# EAGLE design PCB (EAGLE 9.5.1)
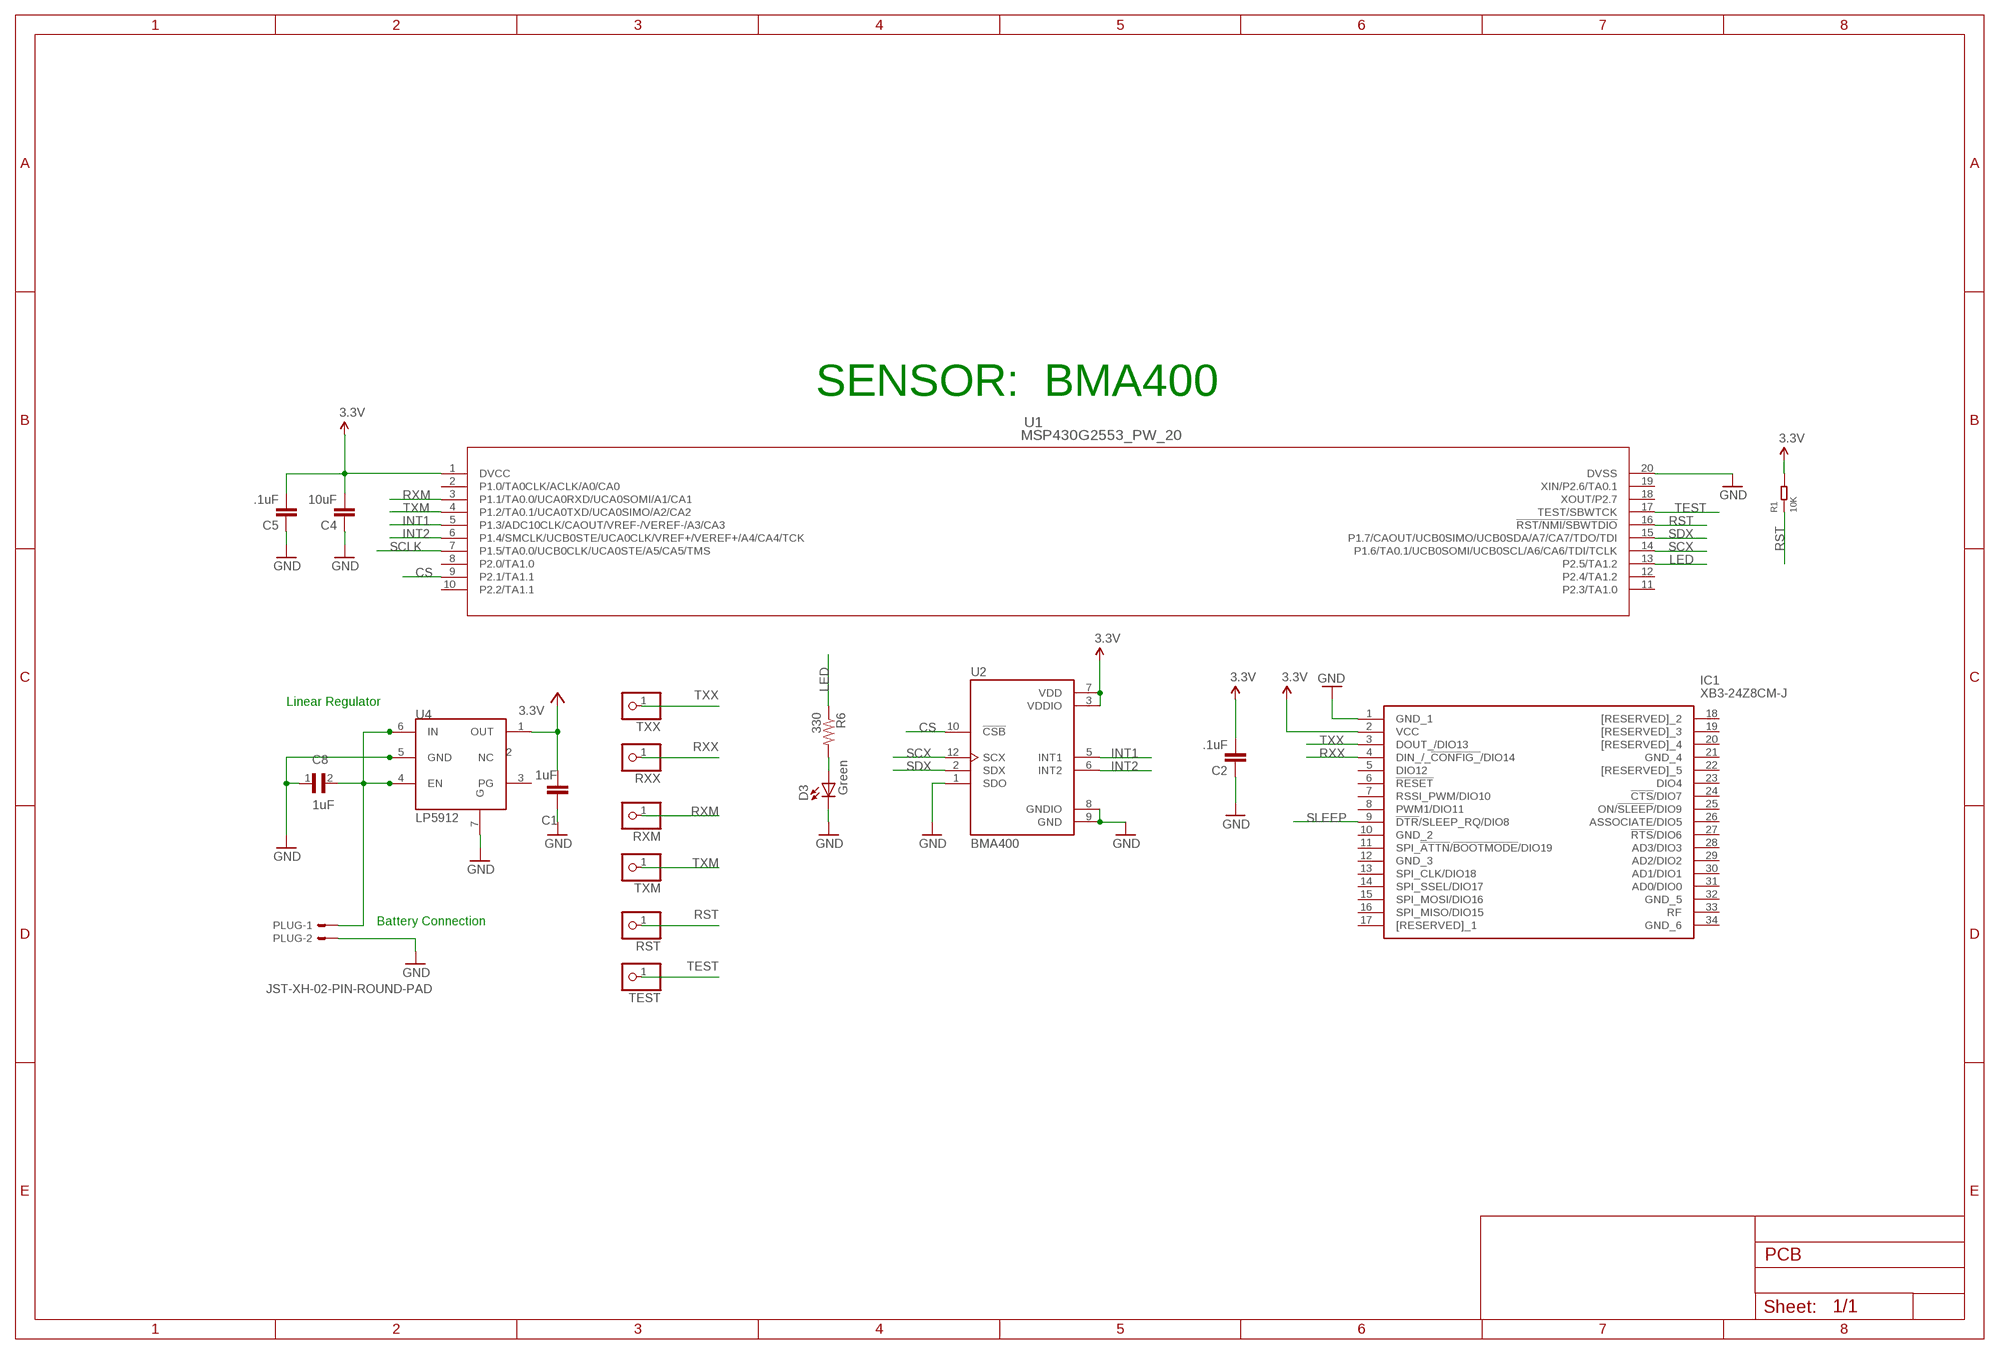
[diagram p0: schematic, sheet 1]

## Parts
C1  1uF  C-EUC0603  [C0603]
C2  .1uF  0.1UF-25V(+80/-20%)(0603)  [0603-CAP]
C4  10uF  0.1UF-25V(+80/-20%)(0603)  [0603-CAP]
C5  .1uF  0.1UF-25V(+80/-20%)(0603)  [0603-CAP]
C8  1uF  0402YD105MAT2A  [CAPC1005X71N]
D3  Green  LED  [0603-LED-ALT1]
IC1  XB3-24Z8CM-J  [XB324Z8CMJ]
PLUG  JST-XH-02-PIN-ROUND-PAD  [JST-XH-02-PACKAGE-ROUND-PAD]
R1  10K  SMD-RES-4.7K-5%-1/16W(0402)  [R0402]
R6  330  RESISTOR0603-RES  [0603-RES]
RST  PINHD-1X1  [1X01]
RXM  PINHD-1X1  [1X01]
RXX  PINHD-1X1  [1X01]
TEST  PINHD-1X1  [1X01]
TXM  PINHD-1X1  [1X01]
TXX  PINHD-1X1  [1X01]
U1  MSP430G2553_PW_20  [PW20]
U2  BMA400  [XDCR_BMA400]
U4  LP5912  [LP5912]

## Nets
3.3V: C2.2 C4.2 C5.2 IC1.2(VCC) R1.2 U1.1(DVCC) U2.3(VDDIO) U2.7(VDD)
BATTERY: C8.2 PLUG.1 U4.4(EN) U4.6(IN)
CS: U1.9(P2.1/TA1.1) U2.10(!CSB)
GND [vcc]: C1.1 C2.1 C4.1 C5.1 C8.1 D3.C IC1.1(GND_1) PLUG.2 U1.20(DVSS) U2.1(SDO) U2.8(GNDIO) U2.9(GND) U4.5(GND) U4.7(G)
INT1: U1.5(P1.3/ADC10CLK/CAOUT/VREF-/VEREF-/A3/CA3) U2.5(INT1)
INT2: U1.6(P1.4/SMCLK/UCB0STE/UCA0CLK/VREF+/VEREF+/A4/CA4/TCK) U2.6(INT2)
LED: R6.1 U1.13(P2.5/TA1.2)
N$7: D3.A R6.2
RST: R1.1 RST.1 U1.16(!RST/NMI/SBWTDIO)
RXM: RXM.1 U1.3(P1.1/TA0.0/UCA0RXD/UCA0SOMI/A1/CA1)
RXX: IC1.4(DIN_/_!CONFIG_!/DIO14) RXX.1
SCLK: U1.7(P1.5/TA0.0/UCB0CLK/UCA0STE/A5/CA5/TMS)
SCX: U1.14(P1.6/TA0.1/UCB0SOMI/UCB0SCL/A6/CA6/TDI/TCLK) U2.12(SCX)
SDX: U1.15(P1.7/CAOUT/UCB0SIMO/UCB0SDA/A7/CA7/TDO/TDI) U2.2(SDX)
SLEEP: IC1.9(!DTR!/SLEEP_RQ/DIO8)
TEST: TEST.1 U1.17(TEST/SBWTCK)
TXM: TXM.1 U1.4(P1.2/TA0.1/UCA0TXD/UCA0SIMO/A2/CA2)
TXX: IC1.3(DOUT_/DIO13) TXX.1
VCC: C1.2 U4.1(OUT) ; supply symbol labelled 3.3V
Unconnected: IC1.5(DIO12) IC1.6(!RESET) IC1.7(RSSI_PWM/DIO10) IC1.8(PWM1/DIO11) IC1.10(GND_2) IC1.11(SPI_!ATTN!/!BOOTMODE!/DIO19) IC1.12(GND_3) IC1.13(SPI_CLK/DIO18) IC1.14(SPI_SSEL/DIO17) IC1.15(SPI_MOSI/DIO16) IC1.16(SPI_MISO/DIO15) IC1.17([RESERVED]_1) IC1.18([RESERVED]_2) IC1.19([RESERVED]_3) IC1.20([RESERVED]_4) IC1.21(GND_4) IC1.22([RESERVED]_5) IC1.23(DIO4) IC1.24(!CTS!/DIO7) IC1.25(ON/!SLEEP!/DIO9) IC1.26(ASSOCIATE/DIO5) IC1.27(!RTS!/DIO6) IC1.28(AD3/DIO3) IC1.29(AD2/DIO2) IC1.30(AD1/DIO1) IC1.31(AD0/DIO0) IC1.32(GND_5) IC1.33(RF) IC1.34(GND_6) U1.2(P1.0/TA0CLK/ACLK/A0/CA0) U1.8(P2.0/TA1.0) U1.10(P2.2/TA1.1) U1.11(P2.3/TA1.0) U1.12(P2.4/TA1.2) U1.18(XOUT/P2.7) U1.19(XIN/P2.6/TA0.1) U4.2(NC) U4.3(PG)

## Notes on the sheet
- SENSOR:  BMA400
- Linear Regulator
- Battery Connection

## Library data of the parts
C1 = rcl:C-EU: CAPACITOR, European symbol; SPICEPREFIX: C
C2 C4 C5 = SparkFun-Capacitors:0.1UF-25V(+80/-20%)(0603): CAP-00810 Ceramic Standard decoupling cap; PROD_ID: CAP-00810; VALUE: 0.1uF
C8 = Capacitor1uF:0402YD105MAT2A: CAP 1UF 16VDC X5R 20% SMD 0402; AVAILABILITY: Unavailable; DESCRIPTION: Cap 1uf 16vdc X5r 20% Smd 0402; MF: AVX; MP: 0402YD105MAT2A; PACKAGE: 1005 AVX; PRICE: None
D3 = Testing:LED: LEDs Standard schematic elements and footprints for 5mm, 3mm, 1206, and 0603 sized LEDs. 5mm - Spark Fun Electronics SKU : COM-00529 (and others)
IC1 = XB3-24Z8CM-J:XB3-24Z8CM-J: Zigbee Modules (802.15.4) XBee3 ,2.4 Ghz ZB 3.0, Chip Ant, MMT Source: Datasheet <https://www.digi.com/resources/documentation/digidocs/pdfs/90001543.pdf>; DESCRIPTION: Zigbee Modules (802.15.4) XBee3 ,2.4 Ghz ZB 3.0, Chip Ant, MMT; HEIGHT: 4mm; MANUFACTURER_NAME: Digi International; MANUFACTURER_PART_NUMBER: XB3-24Z8CM-J; MOUSER_PART_NUMBER: 888-XB3-24Z8CM-J; MOUSER_PRICE-STOCK: https://www.mouser.com/Search/Refine.aspx?Keyword=888-XB3-24Z8CM-J
PLUG = Rembrandt Electronics - JST XH Connectors v1-0:JST-XH-02-PIN: JST XH Connector 2 Pin Wire to board connector. Pitch: 2,54 mm, (0.100") Number of pins: 2 Created by Rembrandt Electronics www.rembrandtelectronics.com
R1 = RES-4.7K-SMD-5_-1_16W_0402_:SMD-RES-4.7K-5%-1/16W(0402): 301010010; AVAILABILITY: Unavailable; DESCRIPTION: Res Thick Film 0402 4.7K Ohm 5% 0.063W_1/16W_ ?100ppm/C Molded SMD Paper T/R; MF: Yageo; MP: RC0402JR074K7L; PACKAGE: 0402 Yageo; PRICE: None
R6 = SparkFun:RESISTOR: Resistor Basic schematic elements and footprints for 0603, 1206, and PTH resistors.
RST RXM RXX TEST TXM TXX = pinhead:PINHD-1X1: PIN HEADER
U1 = MSP430G2553_PW_20:MSP430G2553_PW_20; BUILT_BY: EMA_UL_Team; MANUFACTURER: Texas Instruments; MANUFACTURER_PART_NUMBER: MSP430G2553_PW_20; VENDOR: Texas Instruments
U2 = BMA400:BMA400: Ultra low power, 12-bit digital triaxial accelerometer; AVAILABILITY: Unavailable; DESCRIPTION: Accelerometer X, Y, Z Axis ±2g, 4g, 8g, 16g 12-LGA _2x2_; MF: Bosch Sensortec; MP: BMA400; PACKAGE: LGA-12 Bosch Tools; PRICE: None
U4 = electronic-labs:LP5912

## Net classes
0 default: width 0.203 mm
1 vcc: width 0.254 mm

## Board
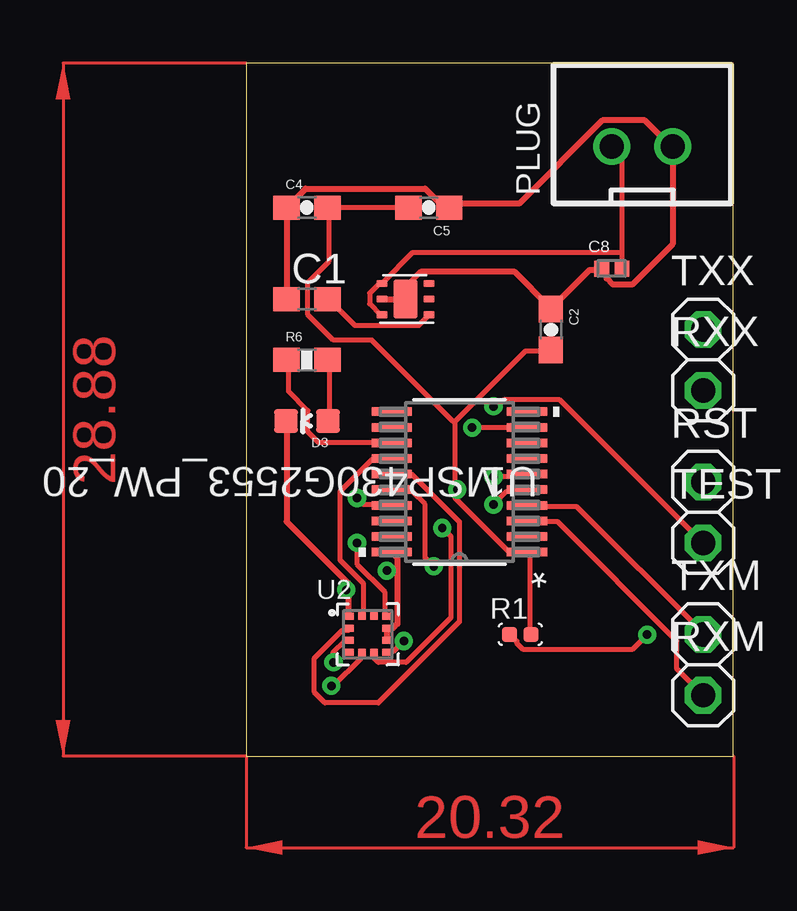
[diagram p1: board, top side]
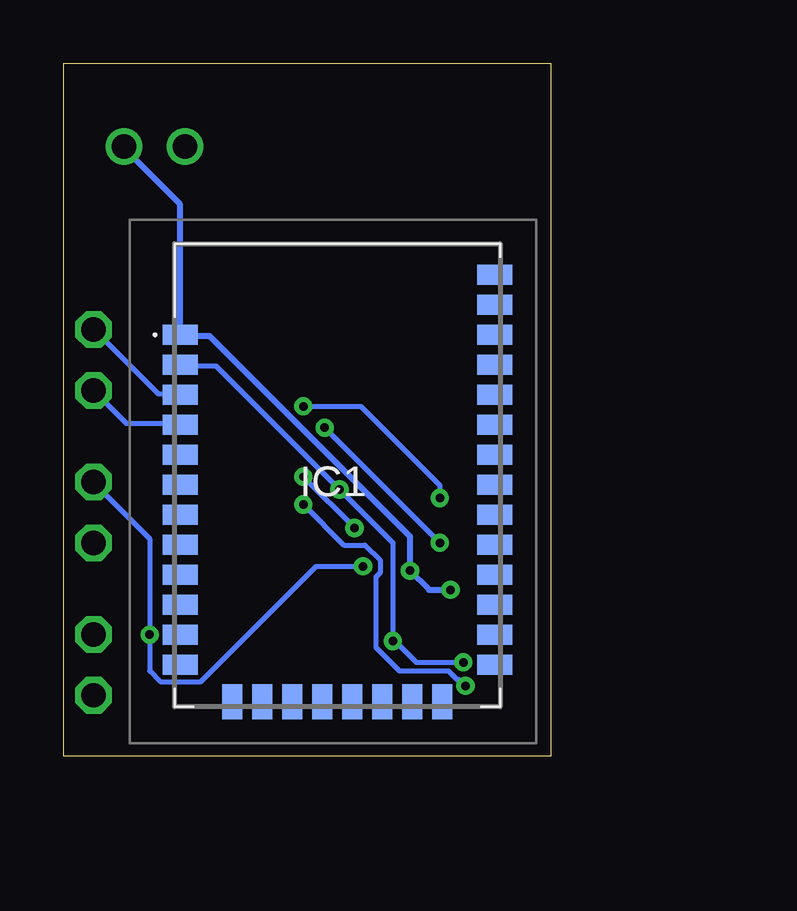
[diagram p2: board, bottom side, seen from below]

Size 20.3 x 28.88 mm. Coordinates in mm from the lower left corner, seen from the top.
Outline: 0,0 20.3,0 20.3,28.88 0,28.88 0,0
Copper layers (1*16): Top 0.035mm / dielectric 1.5mm / Bottom 0.035mm
Design rules "default": minimum track width 6mil, minimum drill 0.35mm, track to track 6mil, track to pad 6mil, pad to pad 6mil, via to via 6mil, smd to smd 6mil, copper to edge 40mil, drill to drill 6mil, minimum pad ring 10mil, minimum via ring 8mil, stop-mask expansion 4mil, vias tented up to drill 0mil, thermal gap 10mil

### Footprints (pad centres in the part's own frame; a part is rotated, then mirrored left to right if it is on the bottom)
C0603 = smd 1.1 x 1: 1 -0.85,0; 2 0.85,0
0603-CAP = smd 1.1 x 1: 1 -0.85,0; 2 0.85,0
CAPC1005X71N = smd 0.62 x 0.67: 1 -0.425,0; 2 0.425,0
0603-LED-ALT1 = smd 1 x 1: A 0,-0.877; C 0,0.877
XB324Z8CMJ = smd 1.448 x 0.838: 1 -6.553,13.75; 2 -6.553,12.5; 3 -6.553,11.25; 4 -6.553,10; 5 -6.553,8.75; 6 -6.553,7.5; 7 -6.553,6.25; 8 -6.553,5; 9 -6.553,3.75; 10 -6.553,2.5; 11 -6.553,1.25; 12 -6.553,0; 21 6.553,0; 22 6.553,1.25; 23 6.553,2.5; 24 6.553,3.75; 25 6.553,5; 26 6.553,6.25; 27 6.553,7.5; 28 6.553,8.75; 29 6.553,10; 30 6.553,11.25; 31 6.553,12.5; 32 6.553,13.75; 33 6.553,15; 34 6.553,16.25 | smd 0.838 x 1.448: 13 -4.375,-1.537; 14 -3.125,-1.537; 15 -1.875,-1.537; 16 -0.625,-1.537; 17 0.625,-1.537; 18 1.875,-1.537; 19 3.125,-1.537; 20 4.375,-1.537
JST-XH-02-PACKAGE-ROUND-PAD = drill 1.016: 1 -1.27,0; 2 1.27,0
R0402 = smd 0.635 x 0.635: 1 0,0.445; 2 0,-0.445
0603-RES = smd 1.1 x 1: 1 -0.85,0; 2 0.85,0
1X01 = drill 1.016 octagon: 1 0,0
PW20 = smd 1.676 x 0.356: 1 -2.819,2.925; 2 -2.819,2.275; 3 -2.819,1.625; 4 -2.819,0.975; 5 -2.819,0.325; 6 -2.819,-0.325; 7 -2.819,-0.975; 8 -2.819,-1.625; 9 -2.819,-2.275; 10 -2.819,-2.925; 11 2.819,-2.925; 12 2.819,-2.275; 13 2.819,-1.625; 14 2.819,-0.975; 15 2.819,-0.325; 16 2.819,0.325; 17 2.819,0.975; 18 2.819,1.625; 19 2.819,2.275; 20 2.819,2.925
XDCR_BMA400 = smd 0.35 x 0.3: 1 -0.775,0.75; 2 -0.775,0.25; 3 -0.775,-0.25; 4 -0.775,-0.75; 7 0.775,-0.75; 8 0.775,-0.25; 9 0.775,0.25; 10 0.775,0.75 | smd 0.3 x 0.35: 5 -0.25,-0.775; 6 0.25,-0.775; 11 0.25,0.775; 12 -0.25,0.775
LP5912 = smd 0.45 x 0.3: 1 0,0.65; 2 0,0; 3 0,-0.65; 4 1.95,-0.65; 5 1.95,0; 6 1.95,0.65 | smd 1 x 1.6: 7 0.975,0

### Placement (x,y rotation side)
C1  2.54,19.05 0 top
C2  12.7,17.78 270 top
C4  2.54,22.86 0 top
C5  7.62,22.86 180 top
C8  15.24,20.32 0 top
D3  2.54,13.97 90 top
IC1  8.89,3.81 0 bottom
PLUG  16.51,25.4 0 top
R1  11.43,5.08 90 top
R6  2.54,16.51 0 top
RST  19.05,11.43 0 top
RXM  19.05,2.54 0 top
RXX  19.05,15.24 0 top
TEST  19.05,8.89 0 top
TXM  19.05,5.08 0 top
TXX  19.05,17.78 0 top
U1  8.89,11.43 180 top
U2  5.08,5.08 0 top
U4  7.62,19.05 180 top

### Tracks (layer width: path | path; a pad name or v marks a point on that pad's centre or on a via)
3.3V  (via drill 0.35)
  Top 0.203: v6.58,4.8 6.13,4.36 5.87,4.36 U2.7 | v3.65,3.91 3.65,4.36 4.09,4.8 4.27,4.8 U2.3 | C5.2 6.76,22.85 3.47,22.85 C4.2 3.47,22.76 3.47,20.62 2.58,19.74 2.58,18.4 3.65,17.34 5.25,17.34 8.62,13.96 8.71,13.96 | R1.2 11.82,5.16 11.82,8.36 11.73,8.45 U1.1 11.65,8.53 10.94,8.53 8.71,10.76 8.71,11.11 | 8.71,13.96 11.65,16.89 12.62,16.89 C2.2 | 8.71,11.11 8.71,13.96 | v8.8,11.11 8.71,11.11
  Bottom 0.203: IC1.2 15.38,16.27 13.96,16.27 v8.8,11.11 6.58,8.89 v6.58,4.8 6.49,4.8 5.6,3.91 v3.65,3.91
BATTERY
  Top 0.203: U4.6 5.6,18.4 5.16,18.85 5.16,19.29 5.6,19.74 U4.4 5.69,19.74 6.93,20.98 15.65,20.98 | 15.65,20.98 15.65,24.98 15.29,25.34 PLUG.1 | 15.65,20.98 15.65,20.36 C8.2
CS  (via drill 0.35)
  Top 0.203: v4.62,8.89 4.62,8 5.78,6.84 5.78,5.87 U2.10 | v9.42,13.69 11.65,13.69 U1.9
  Bottom 0.203: v9.42,13.69 v4.62,8.89
GND  (via drill 0.35)
  Top 0.254: C1.1 1.69,19.11 1.69,22.85 C4.1 1.78,22.94 2.49,23.65 7.47,23.65 8.18,22.94 8.45,22.94 C5.1 8.53,23.02 11.38,23.02 14.85,26.49 16.62,26.49 17.69,25.43 PLUG.2 17.78,21.34 16.09,19.65 15.29,19.65 15.02,19.91 15.02,20 14.85,20.18 C8.1 14.76,20.27 14.31,20.27 12.71,18.67 C2.1 12.62,18.76 11.2,20.18 7.29,20.18 6.76,19.65 6.76,19.11 U4.7 6.58,19.02 5.69,19.02 U4.5 | 4.27,6.93 4.27,7.2 1.69,9.78 1.69,13.96 D3.C | 4.27,6.93 4.27,5.87 U2.1 | U2.8 5.87,4.89 5.87,5.25 U2.9 5.96,5.33 6.13,5.33 6.31,5.51 6.31,7.73 | 6.31,7.73 6.31,8.27 6.13,8.45 U1.20 | v5.87,7.73 6.31,7.73 | v4.18,6.93 4.27,6.93
  Bottom 0.254: PLUG.2 17.78,25.34 15.47,23.02 15.47,17.6 IC1.1 15.38,17.51 14.22,17.51 5.87,9.16 v5.87,7.73 5.07,6.93 v4.18,6.93
INT1  (via drill 0.35)
  Top 0.203: v3.56,2.93 3.65,2.93 4.8,4.09 4.8,4.27 U2.5 | v10.31,10.49 10.85,11.02 11.65,11.02 U1.5
  Bottom 0.203: v3.56,2.93 3.82,3.2 3.91,3.2 4.27,3.56 6.31,3.56 7.29,4.53 7.29,7.47 7.11,7.64 7.11,8.18 7.73,8.8 8.62,8.8 v10.31,10.49
INT2  (via drill 0.35)
  Top 0.203: v8.18,9.51 8.53,9.16 8.53,5.78 6.67,3.91 5.51,3.91 5.33,4.09 5.33,4.27 U2.6 | v10.31,11.65 11.56,11.65 11.65,11.73 U1.6
  Bottom 0.203: v10.31,11.65 v8.18,9.51
LED
  Top 0.203: R6.1 1.78,16.45 1.78,15.2 2.58,14.4 2.58,13.51 3.02,13.07 6.04,13.07 U1.13
N$7
  Top 0.203: D3.A 3.47,14.05 3.47,16.45 R6.2
RST  (via drill 0.35)
  Top 0.203: v16.71,5.07 16.09,4.45 11.56,4.45 11.29,4.71 11.29,4.8 11.02,5.07 R1.1 | v7.82,7.91 7.47,8.27 7.47,10.49 6.93,11.02 6.13,11.02 U1.16
  Bottom 0.203: RST.1 19.02,11.38 16.71,9.07 v16.71,5.07 16.71,3.56 16.27,3.11 14.58,3.11 9.78,7.91 v7.82,7.91
RXM
  Top 0.203: U1.3 11.73,9.78 12.98,9.78 17.96,4.8 17.96,3.65 19.02,2.58 RXM.1
RXX
  Bottom 0.203: IC1.4 15.47,13.87 17.69,13.87 19.02,15.2 RXX.1
SCX
  Top 0.203: U2.12 4.89,5.87 4.89,7.2 3.91,8.18 3.91,11.02 5.25,12.36 6.04,12.36 U1.14
SDX
  Top 0.203: U2.2 4.27,5.25 4,5.25 2.85,4.09 2.85,2.67 3.29,2.22 5.51,2.22 8.89,5.6 8.89,9.78 6.93,11.73 6.13,11.73 U1.15
TEST  (via drill 0.35)
  Top 0.203: v4.62,10.76 4.89,10.49 6.04,10.49 U1.17 | v10.31,14.58 10.49,14.58 10.76,14.85 13.07,14.85 19.02,8.89 TEST.1
  Bottom 0.203: v4.62,10.76 4.62,11.29 7.91,14.58 v10.31,14.58
TXM
  Top 0.203: U1.4 11.73,10.4 13.78,10.4 19.02,5.16 TXM.1
TXX
  Bottom 0.203: IC1.3 15.47,15.11 16.36,15.11 19.02,17.78 TXX.1
VCC
  Top 0.203: U4.1 7.56,18.31 7.2,17.96 4.53,17.96 3.47,19.02 C1.2
(copper drawn outside any net)
  shapes: Top area x2